# EasyEDA schematic SCH_ea-masterboard_2025-10-05.json
TITLE: MAIN board; REV: 1.0; Date: 2025-07-06; Sheet: 1/1; Drawn By: Jirka Svítil; Company: Energetická gramotnost
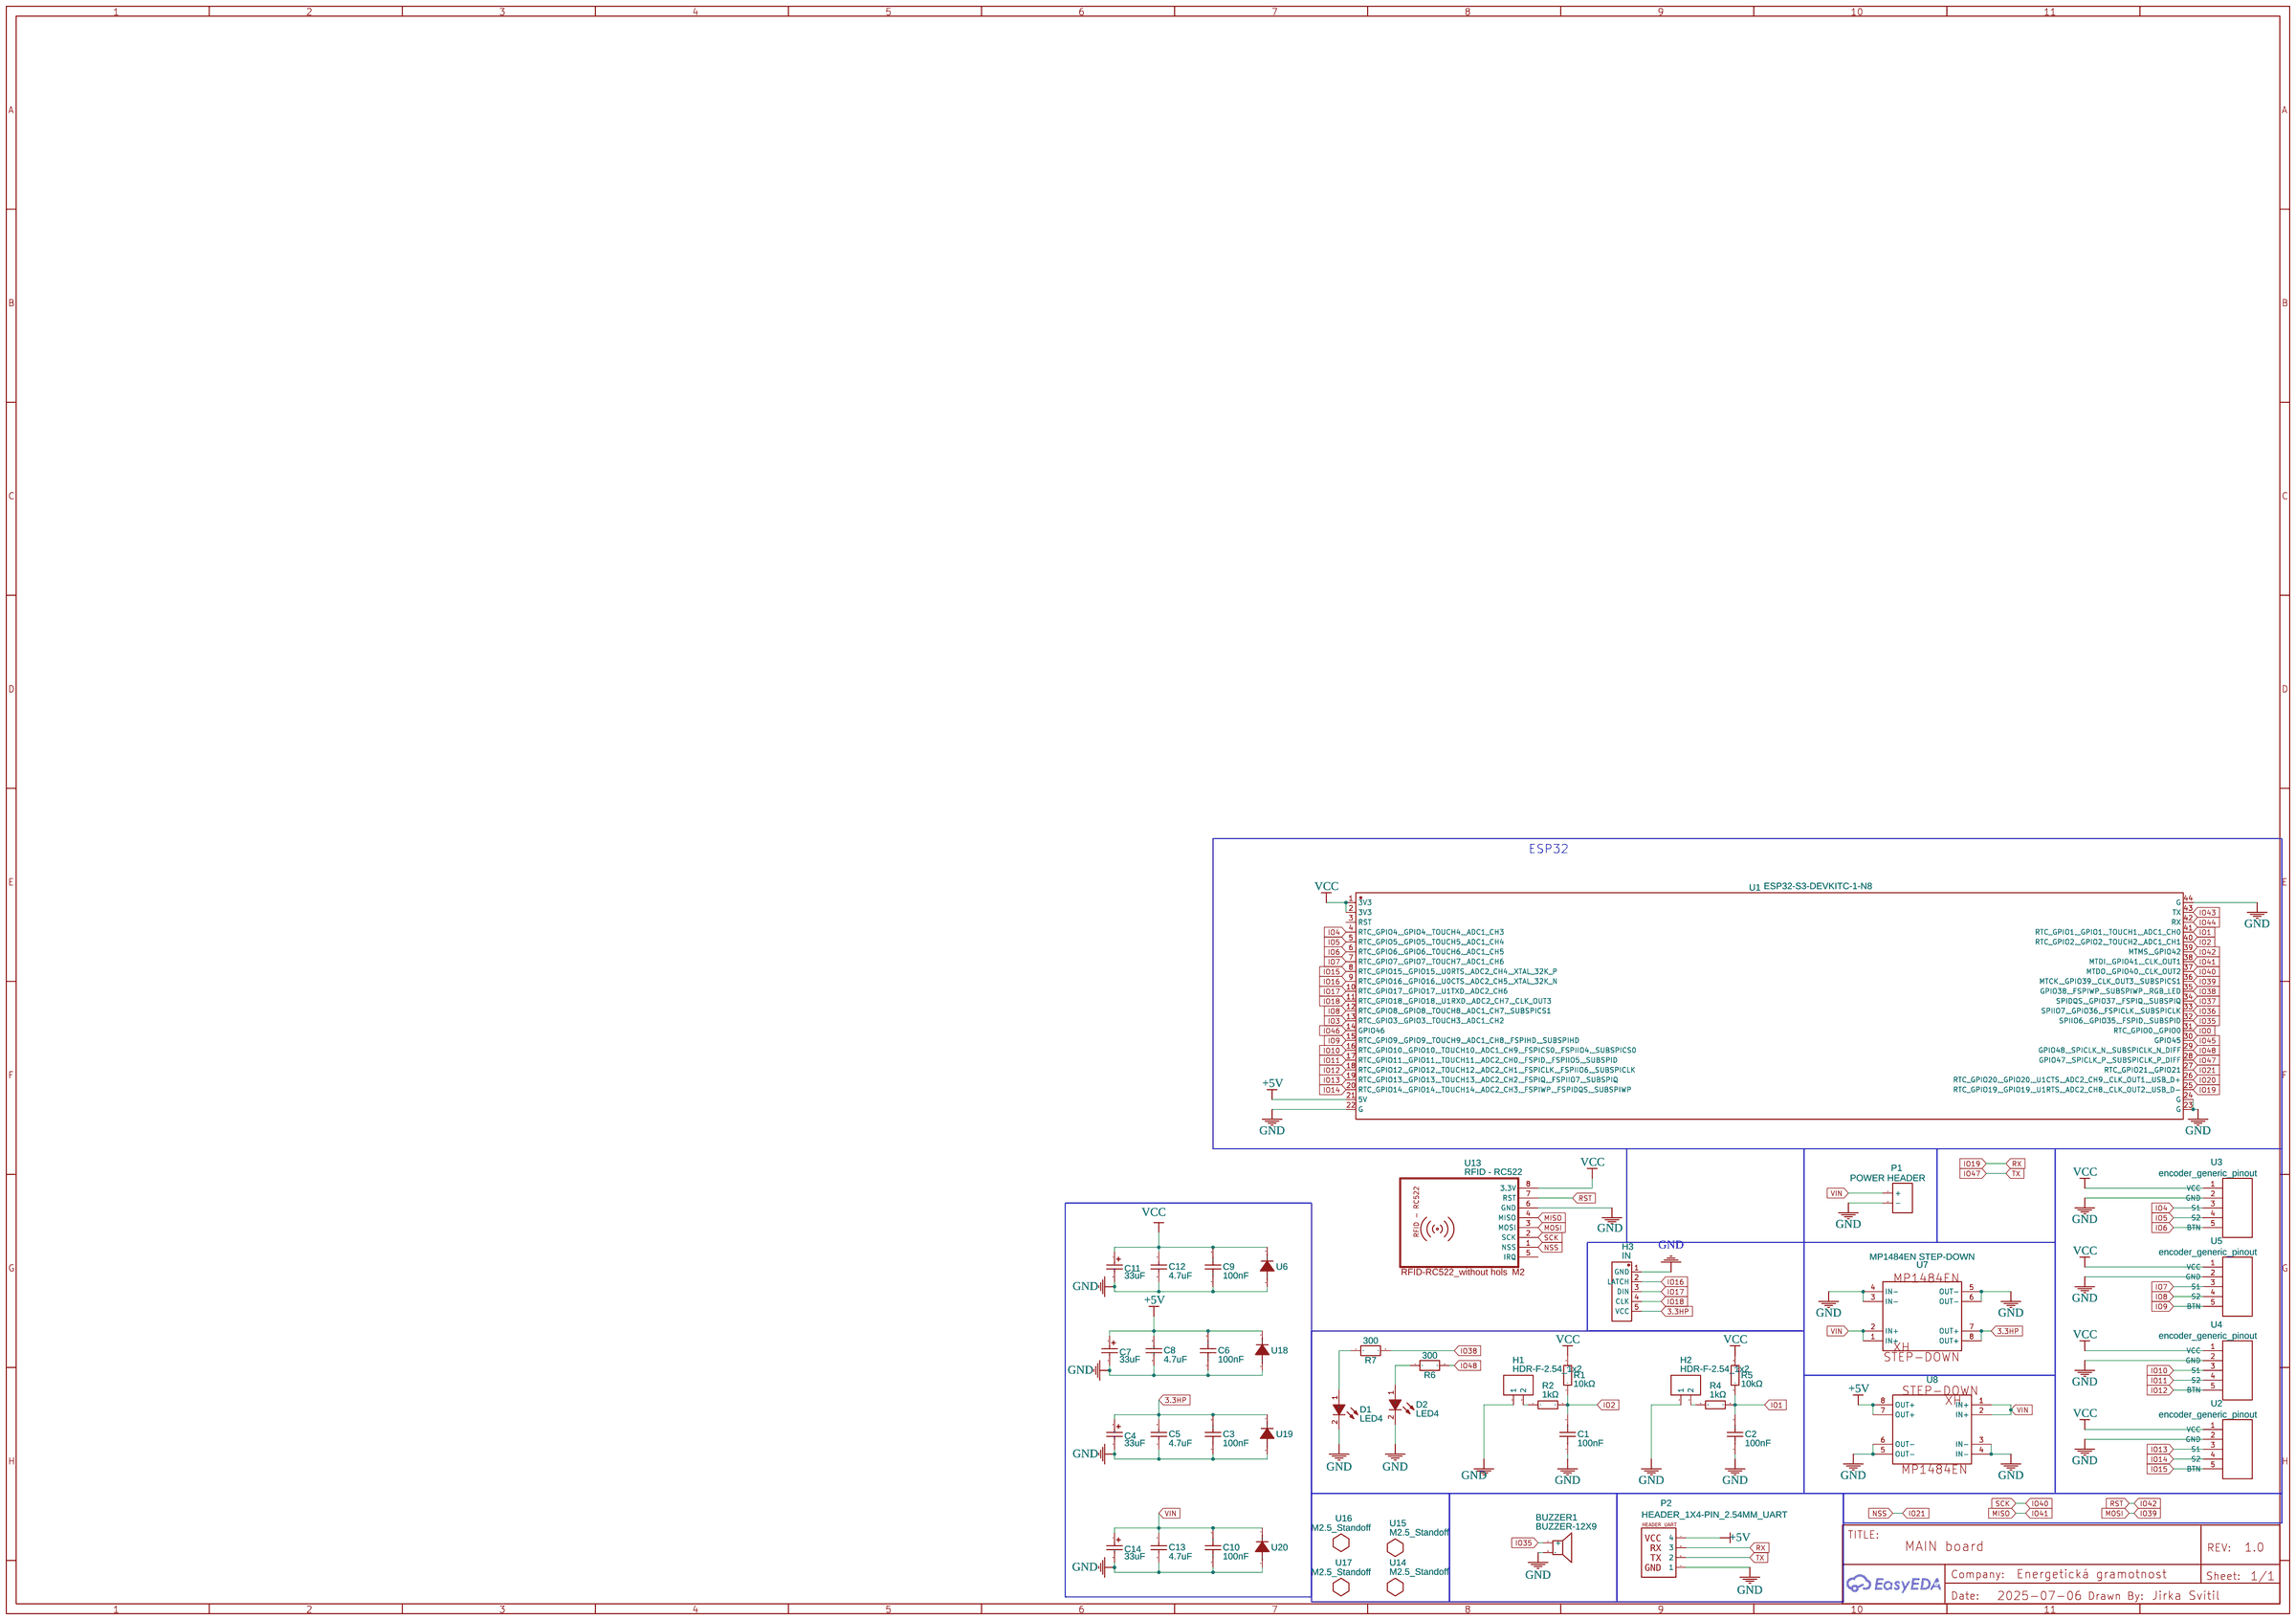
[diagram p0: schematic sheet]

## Parts
BUZZER1  BUZZER-12X9  [BUZ-TH_BD12.0-P7.60-D0.6-FD]
C1  100nF  [C0603]
C2  100nF  [C0603]
C3  100nF  [C0603]
C4  33uF  [CASE-A_3216]
C5  4.7uF  [C0603]
C6  100nF  [C0603]
C7  33uF  [CASE-A_3216]
C8  4.7uF  [C0603]
C9  100nF  [C0603]
C10  100nF  [C0603]
C11  33uF  [CASE-A_3216]
C12  4.7uF  [C0603]
C13  4.7uF  [C0603]
C14  33uF  [CASE-A_3216]
D1  LED4  [LED-TH_LED-DP2-2LED-AMCC_+]
D2  LED4  [LED-TH_LED-DP2-2LED-AMCC_+]
H1  HDR-F-2.54_1x2  [HDR-F-2.54_1X2]
H2  HDR-F-2.54_1x2  [HDR-F-2.54_1X2]
H3  IN  [HEADER-HEADER-FEMALE-2.54_1X5]
P1  POWER HEADER  [POWER HEADER]
P2  HEADER_1X4-PIN_2.54MM_UART  [HEADER_1X4-PIN_2.54MM_UART]
R1  10kΩ  [R0603]
R2  1kΩ  [R0603]
R4  1kΩ  [R0603]
R5  10kΩ  [R0603]
R6  300  [R0603]
R7  300  [R0603]
U1  ESP32-S3-DEVKITC-1-N8  [CONN-TH_ESP32-S3-DEVKITC-1U-N8]
U2  encoder_generic_pinout  [ENCODER]
U3  encoder_generic_pinout  [ENCODER]
U4  encoder_generic_pinout  [ENCODER]
U5  encoder_generic_pinout  [ENCODER]
U6  S3M_C4154420  [SMA_L4.4-W2.5-LS5.0-RD]
U7  MP1484EN STEP-DOWN  [MP1484EN STEP-DOWN]
U8  MP1484EN STEP-DOWN  [MP1484EN STEP-DOWN]
U13  RFID - RC522  [RFID-RC522]
U14  M2.5_Standoff  [M2.5_STANDOFF]
U15  M2.5_Standoff  [M2.5_STANDOFF]
U16  M2.5_Standoff  [M2.5_STANDOFF]
U17  M2.5_Standoff  [M2.5_STANDOFF]
U18  S3M_C4154420  [SMA_L4.4-W2.5-LS5.0-RD]
U19  S3M_C4154420  [SMA_L4.4-W2.5-LS5.0-RD]
U20  S3M_C4154420  [SMA_L4.4-W2.5-LS5.0-RD]

## Library data of the parts
BUZZER1 = BUZZER-12X9: Contributor: lcsc; Supplier: LCSC; Supplier Part: C9900016920; Manufacturer: null; Manufacturer Part: buzzer-12X9; JLCPCB Part Class: Extended Part
C1-C3 C6 C9 C10 = CC0603KRX7R9BB104: Supplier: LCSC; Manufacturer: YAGEO(国巨); Supplier Part: C14663; JLCPCB Part Class: Basic Part
C4 C7 C11 C14 = CA45-A010K336T: Contributor: LCSC; Supplier: LCSC; Manufacturer: 湘怡中元/湘江; Supplier Part: C124031; JLCPCB Part Class: Extended Part
C5 C8 C12 C13 = CL10A475KP8NNNC: Supplier: LCSC; Manufacturer: SAMSUNG(三星); Supplier Part: C1705; JLCPCB Part Class: Extended Part
D1 D2 = LED: Supplier: Digi-Key; Manufacturer: VccLite; Manufacturer Part: 5600; Supplier Part: L20325-ND; link: https://vcclite.com/product/5602f5-5v/; Contributor: muktiferdi23
H1 H2 = HDR-F-2.54_1x2: Supplier Part: C49661; Supplier: LCSC; Contributor: LCEDA_Lib
H3 = HEADER - 2.54_1X5: Contributor: sohail.hdesign
P1 = POWER HEADER: Supplier: LCSC; Manufacturer: BOOMELE; Manufacturer Part: 2.54-1*2PFemale; image: //image.lceda.cn/szlcsc/C49661.jpg; Supplier Part: C49661
P2 = HEADER_1X4-PIN_2.54MM_UART: Supplier Part: C146243; Supplier: LCSC; Manufacturer: Shanzal Firoz; Manufacturer Part: Header-Female-2.54_1x3; link: https://datasheet.lcsc.com/szlcsc/Boom-Precision-Elec-2-54mm-1-8P-Straight-Female-header_C27438.pdf; Contributor: Shanzal Firoz
R1 R5 = SY0603JN10KP: Contributor: LCSC; Supplier: LCSC; Supplier Part: C380762; Manufacturer: SANYEAR(叁叶源); JLCPCB Part Class: Extended Part
R2 R4 = 0603WAF1001T5E: Supplier: LCSC; Manufacturer: UNI-ROYAL(厚声); Supplier Part: C21190; JLCPCB Part Class: Basic Part
R6 R7 = R_0603_EU: Supplier Part: C2907148; Supplier: LCSC; Contributor: LCEDA_Lib
U1 = ESP32-S3-DEVKITC-1-N8: Supplier: LCSC; Supplier Part: C20438410; Manufacturer: ESPRESSIF(乐鑫); JLCPCB Part Class: Extended Part; Contributor: lcsc
U2-U5 = encoder_generic_pinout: Contributor: jirka.svitil
U6 U18-U20 = S3M_C4154420: Contributor: lcsc; Supplier: LCSC; Supplier Part: C4154420; Manufacturer: TWGMC(台湾迪嘉); Manufacturer Part: S3M; JLCPCB Part Class: Extended Part
U7 U8 = MP1484EN STEP-DOWN: Contributor: Myk-13
U13 = RFID - RC522: Contributor: chama_23
U14-U17 = M2.5_Standoff: Contributor: michael_6605

## Nets
+5V: C6.2 C7.1 C8.2 P2.4 U1.21(5V) U8.7(OUT+) U8.8(OUT+) U18.1
GND: BUZZER1.2 C1.1 C2.1 C3.1 C4.2 C5.1 C6.1 C7.2 C8.1 C9.1 C10.1 C11.2 C12.1 C13.1 C14.2 D1.2(K) D2.2(K) H1.1 H2.1 H3.1(GND) P1.2(-) P2.1 U1.22(G) U1.23(G) U1.24(G) U1.44(G) U2.2(GND) U3.2(GND) U4.2(GND) U5.2(GND) U6.2 U7.3(IN-) U7.4(IN-) U7.5(OUT-) U7.6(OUT-) U8.3(IN-) U8.4(IN-) U8.5(OUT-) U8.6(OUT-) U13.6(GND) U18.2 U19.2 U20.2
VCC: C9.2 C11.1 C12.2 R1.2 R5.2 U1.1(3V3) U1.2(3V3) U2.1(VCC) U3.1(VCC) U4.1(VCC) U5.1(VCC) U6.1 U13.8(3.3V)
VIN: C10.2 C13.2 C14.1 P1.1(+) U7.1(IN+) U7.2(IN+) U8.1(IN+) U8.2(IN+) U20.1
3.3HP: C3.2 C4.1 C5.2 H3.5(VCC) U7.7(OUT+) U7.8(OUT+) U19.1
IO0: U1.31(RTC_GPIO0, GPIO0)
IO1: C2.2 R4.2 R5.1 U1.41(RTC_GPIO1, GPIO1, TOUCH1, ADC1_CH0)
IO2: C1.2 R1.1 R2.2 U1.40(RTC_GPIO2, GPIO2, TOUCH2, ADC1_CH1)
IO3: U1.13(RTC_GPIO3, GPIO3, TOUCH3, ADC1_CH2)
IO4: U1.4(RTC_GPIO4, GPIO4, TOUCH4, ADC1_CH3) U3.3(S1)
IO5: U1.5(RTC_GPIO5, GPIO5, TOUCH5, ADC1_CH4) U3.4(S2)
IO6: U1.6(RTC_GPIO6, GPIO6, TOUCH6, ADC1_CH5) U3.5(BTN)
IO7: U1.7(RTC_GPIO7, GPIO7, TOUCH7, ADC1_CH6) U5.3(S1)
IO8: U1.12(RTC_GPIO8, GPIO8, TOUCH8, ADC1_CH7, SUBSPICS1) U5.4(S2)
IO9: U1.15(RTC_GPIO9, GPIO9, TOUCH9, ADC1_CH8, FSPIHD, SUBSPIHD) U5.5(BTN)
IO10: U1.16(RTC_GPIO10, GPIO10, TOUCH10, ADC1_CH9, FSPICS0, FSPIIO4, SUBSPICS0) U4.3(S1)
IO11: U1.17(RTC_GPIO11, GPIO11, TOUCH11, ADC2_CH0, FSPID, FSPIIO5, SUBSPID) U4.4(S2)
IO12: U1.18(RTC_GPIO12, GPIO12, TOUCH12, ADC2_CH1, FSPICLK, FSPIIO6, SUBSPICLK) U4.5(BTN)
IO13: U1.19(RTC_GPIO13, GPIO13, TOUCH13, ADC2_CH2, FSPIQ, FSPIIO7, SUBSPIQ) U2.3(S1)
IO14: U1.20(RTC_GPIO14, GPIO14, TOUCH14, ADC2_CH3, FSPIWP, FSPIDQS, SUBSPIWP) U2.4(S2)
IO15: U1.8(RTC_GPIO15, GPIO15, U0RTS, ADC2_CH4, XTAL_32K_P) U2.5(BTN)
IO16: H3.2(LATCH) U1.9(RTC_GPIO16, GPIO16, U0CTS, ADC2_CH5, XTAL_32K_N)
IO17: H3.3(DIN) U1.10(RTC_GPIO17, GPIO17, U1TXD, ADC2_CH6)
IO18: H3.4(CLK) U1.11(RTC_GPIO18, GPIO18, U1RXD, ADC2_CH7, CLK_OUT3)
IO19: P2.3 U1.25(RTC_GPIO19, GPIO19, U1RTS, ADC2_CH8, CLK_OUT2, USB_D-)
IO20: U1.26(RTC_GPIO20, GPIO20, U1CTS, ADC2_CH9, CLK_OUT1, USB_D+)
IO21: U1.27(RTC_GPIO21, GPIO21) U13.1(NSS)
IO35: BUZZER1.1(+) U1.32(SPIIO6, GPIO35, FSPID, SUBSPID)
IO36: U1.33(SPIIO7, GPIO36, FSPICLK, SUBSPICLK)
IO37: U1.34(SPIDQS, GPIO37, FSPIQ, SUBSPIQ)
IO38: R7.2 U1.35(GPIO38, FSPIWP, SUBSPIWP, RGB LED)
IO39: U1.36(MTCK, GPIO39, CLK_OUT3, SUBSPICS1) U13.3(MOSI)
IO40: U1.37(MTDO, GPIO40, CLK_OUT2) U13.2(SCK)
IO41: U1.38(MTDI, GPIO41, CLK_OUT1) U13.4(MISO)
IO42: U1.39(MTMS, GPIO42) U13.7(RST)
IO43: U1.43(TX)
IO44: U1.42(RX)
IO45: U1.30(GPIO45)
IO46: U1.14(GPIO46)
IO47: P2.2 U1.28(GPIO47, SPICLK_P, SUBSPICLK_P_DIFF)
IO48: R6.2 U1.29(GPIO48, SPICLK_N, SUBSPICLK_N_DIFF)
Net-(D1-1): D1.1(A) R7.1
Net-(D2-1): D2.1(A) R6.1
Net-(H1-2): H1.2 R2.1
Net-(H2-2): H2.2 R4.1

Not connected (* = marked no-connect by the designer): U1 3(RST); U13 5(IRQ)

## Notes on the sheet
- ESP32
